# EAGLE design pcb_2 (EAGLE 8.6.0)

## Sheet 1 of 2
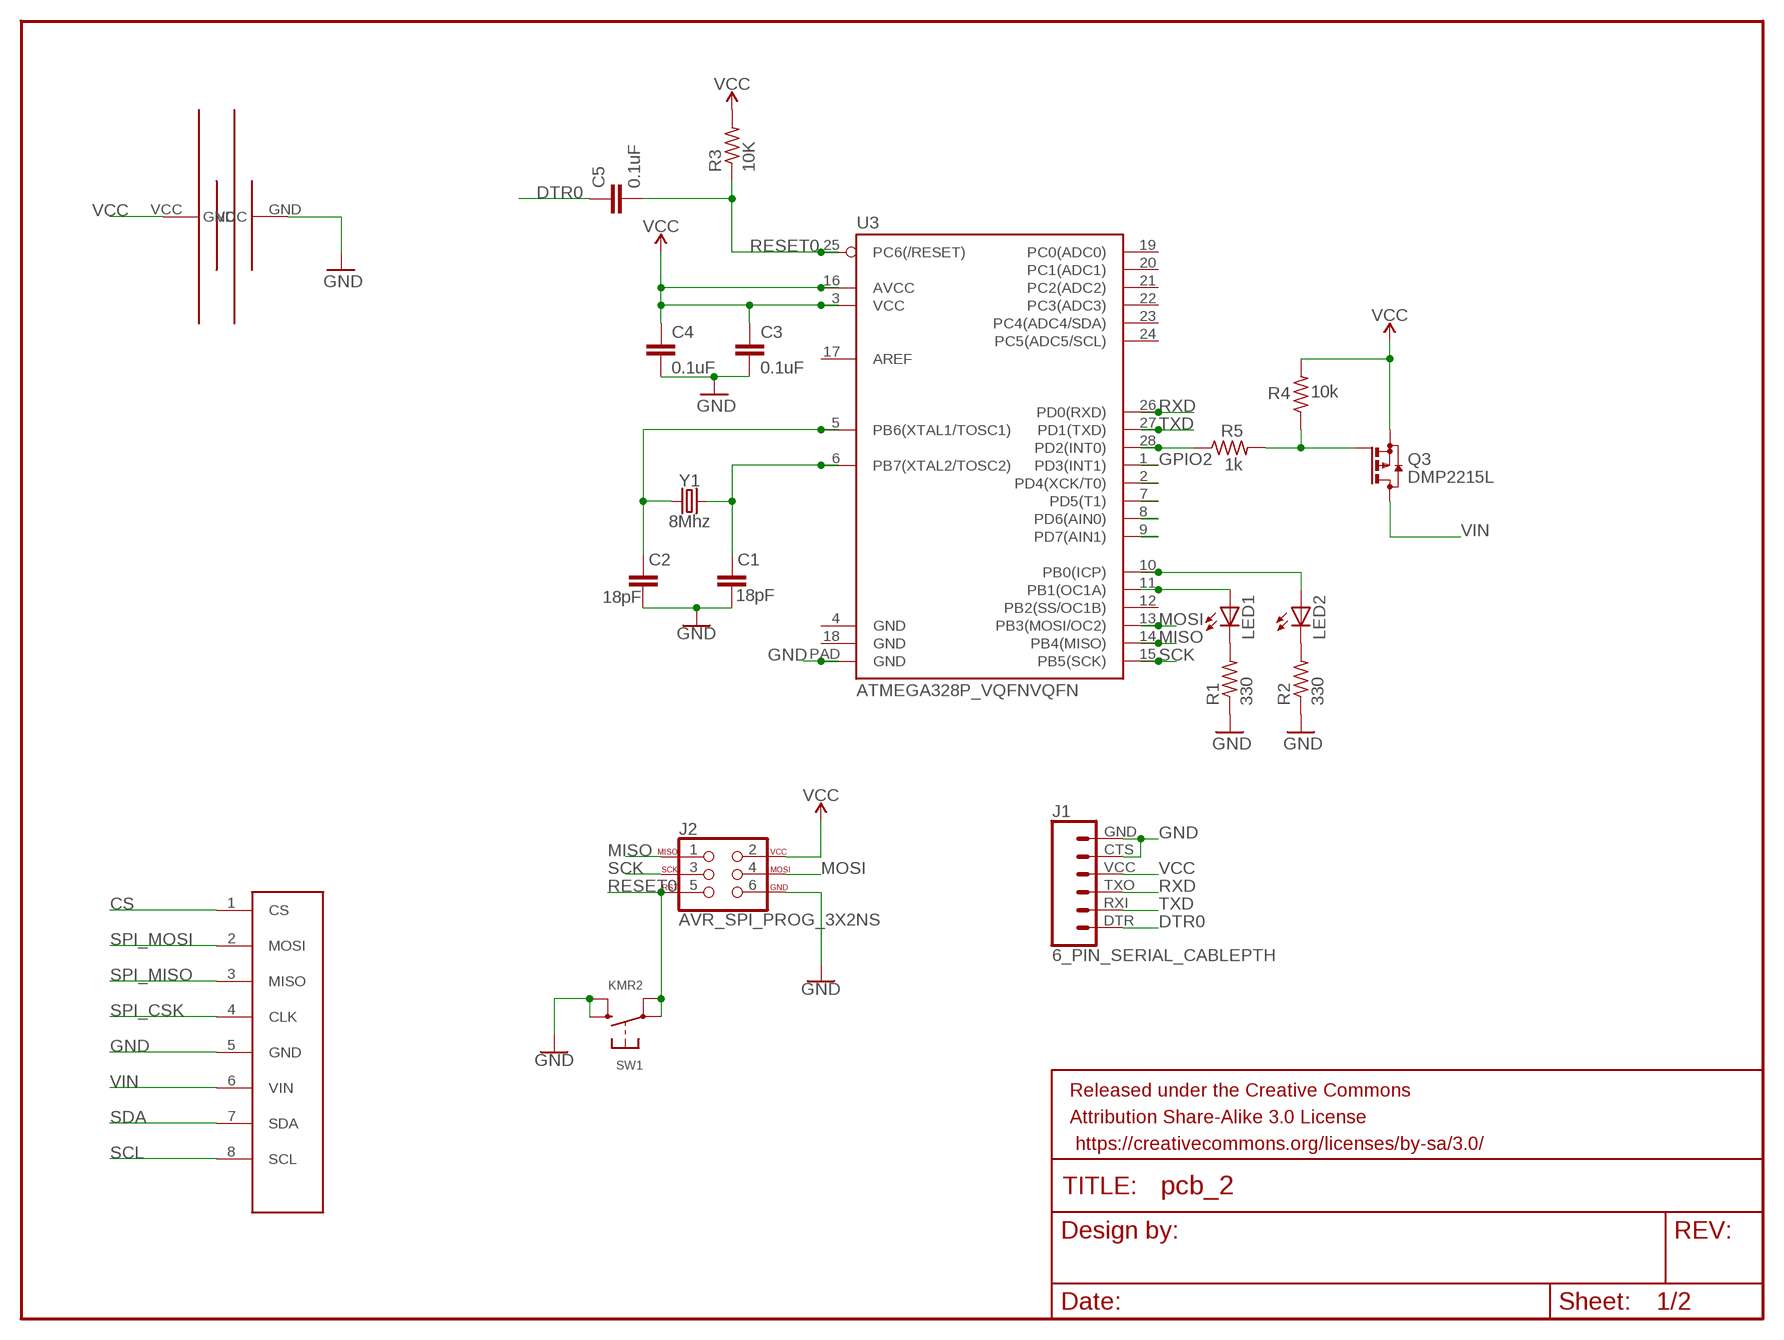
[diagram p0: schematic, sheet 1]

### Parts
C1  18pF  C-EUC0603K  [C0603K]
C2  18pF  C-EUC0603K  [C0603K]
C3  0.1uF  C-EUC0603K  [C0603K]
C4  0.1uF  C-EUC0603K  [C0603K]
C5  0.1uF  C-EUC0603K  [C0603K]
FRAME1  FRAME-LETTER  [CREATIVE_COMMONS]
J1  6_PIN_SERIAL_CABLEPTH  [FTDI_BASIC]
J2  AVR_SPI_PROG_3X2NS  [2X3-NS]
LED1  LED1206  [LED-1206]
LED2  LED1206  [LED-1206]
Q3  DMP2215L  BSS84  [SOT23]
R1  330  R-US_R0603  [R0603]
R2  330  R-US_R0603  [R0603]
R3  10K  R-US_R0603  [R0603]
R4  10k  R-US_R0603  [R0603]
R5  1k  R-US_R0603  [R0603]
SW1  KMR2  SWITCH_TACT_SMT4.6X2.8  [BTN_KMR2_4.6X2.8]
U3  ATMEGA328P_VQFNVQFN  [VQFN-28]
U$1  BATTERY  [D_PACKAGE]
U$6  FLIRFLIR  [1X08_LONGPADS]
Y1  8Mhz  CRYSTALSMD-HC49UP  [HC49UP]

### Nets
CS: U$6.1(CS)
DTR0: C5.1 J1.DTR
FETEN: Q3.1(G) R4.1 R5.2
GND: C1.2 C2.2 C3.2 C4.2 J1.CTS J1.GND J2.6 R1.1 R2.1 SW1.B'(S1) SW1.B(S) U3.PAD(GND) U$1.GND U$6.5(GND) ; also sheet 2
GPIO2: U3.1(PD3(INT1)) ; also sheet 2
MISO: J2.1 U3.14(PB4(MISO))
MOSI: J2.4 U3.13(PB3(MOSI/OC2))
N$1: LED1.C R1.2
N$2: LED1.A U3.11(PB1(OC1A))
N$3: LED2.A U3.10(PB0(ICP))
N$4: U3.9(PD7(AIN1))
N$5: U3.8(PD6(AIN0))
N$6: U3.7(PD5(T1))
N$7: U3.2(PD4(XCK/T0))
N$9: LED2.C R2.2
N$12: R5.1 U3.28(PD2(INT0))
N$19: C1.1 U3.6(PB7(XTAL2/TOSC2)) Y1.2
N$21: C2.1 U3.5(PB6(XTAL1/TOSC1)) Y1.1
RESET0: C5.2 J2.5 R3.1 SW1.A'(P1) SW1.A(P) U3.25(PC6(/RESET))
RXD: J1.TXO U3.26(PD0(RXD))
SCK: J2.3 U3.15(PB5(SCK))
SCL: U$6.8(SCL) ; also sheet 2
SDA: U$6.7(SDA) ; also sheet 2
SPI_CSK: U$6.4(CLK) ; also sheet 2
SPI_MISO: U$6.3(MISO) ; also sheet 2
SPI_MOSI: U$6.2(MOSI) ; also sheet 2
TXD: J1.RXI U3.27(PD1(TXD))
VCC: C3.1 C4.1 J1.VCC J2.2 Q3.2(S) R3.2 R4.2 U3.3(VCC) U3.16(AVCC) U$1.VCC
VIN: Q3.3(D) U$6.6(VIN) ; also sheet 2
Unconnected: U3.4(GND) U3.12(PB2(SS/OC1B)) U3.17(AREF) U3.18(GND) U3.19(PC0(ADC0)) U3.20(PC1(ADC1)) U3.21(PC2(ADC2)) U3.22(PC3(ADC3)) U3.23(PC4(ADC4/SDA)) U3.24(PC5(ADC5/SCL))

## Sheet 2 of 2
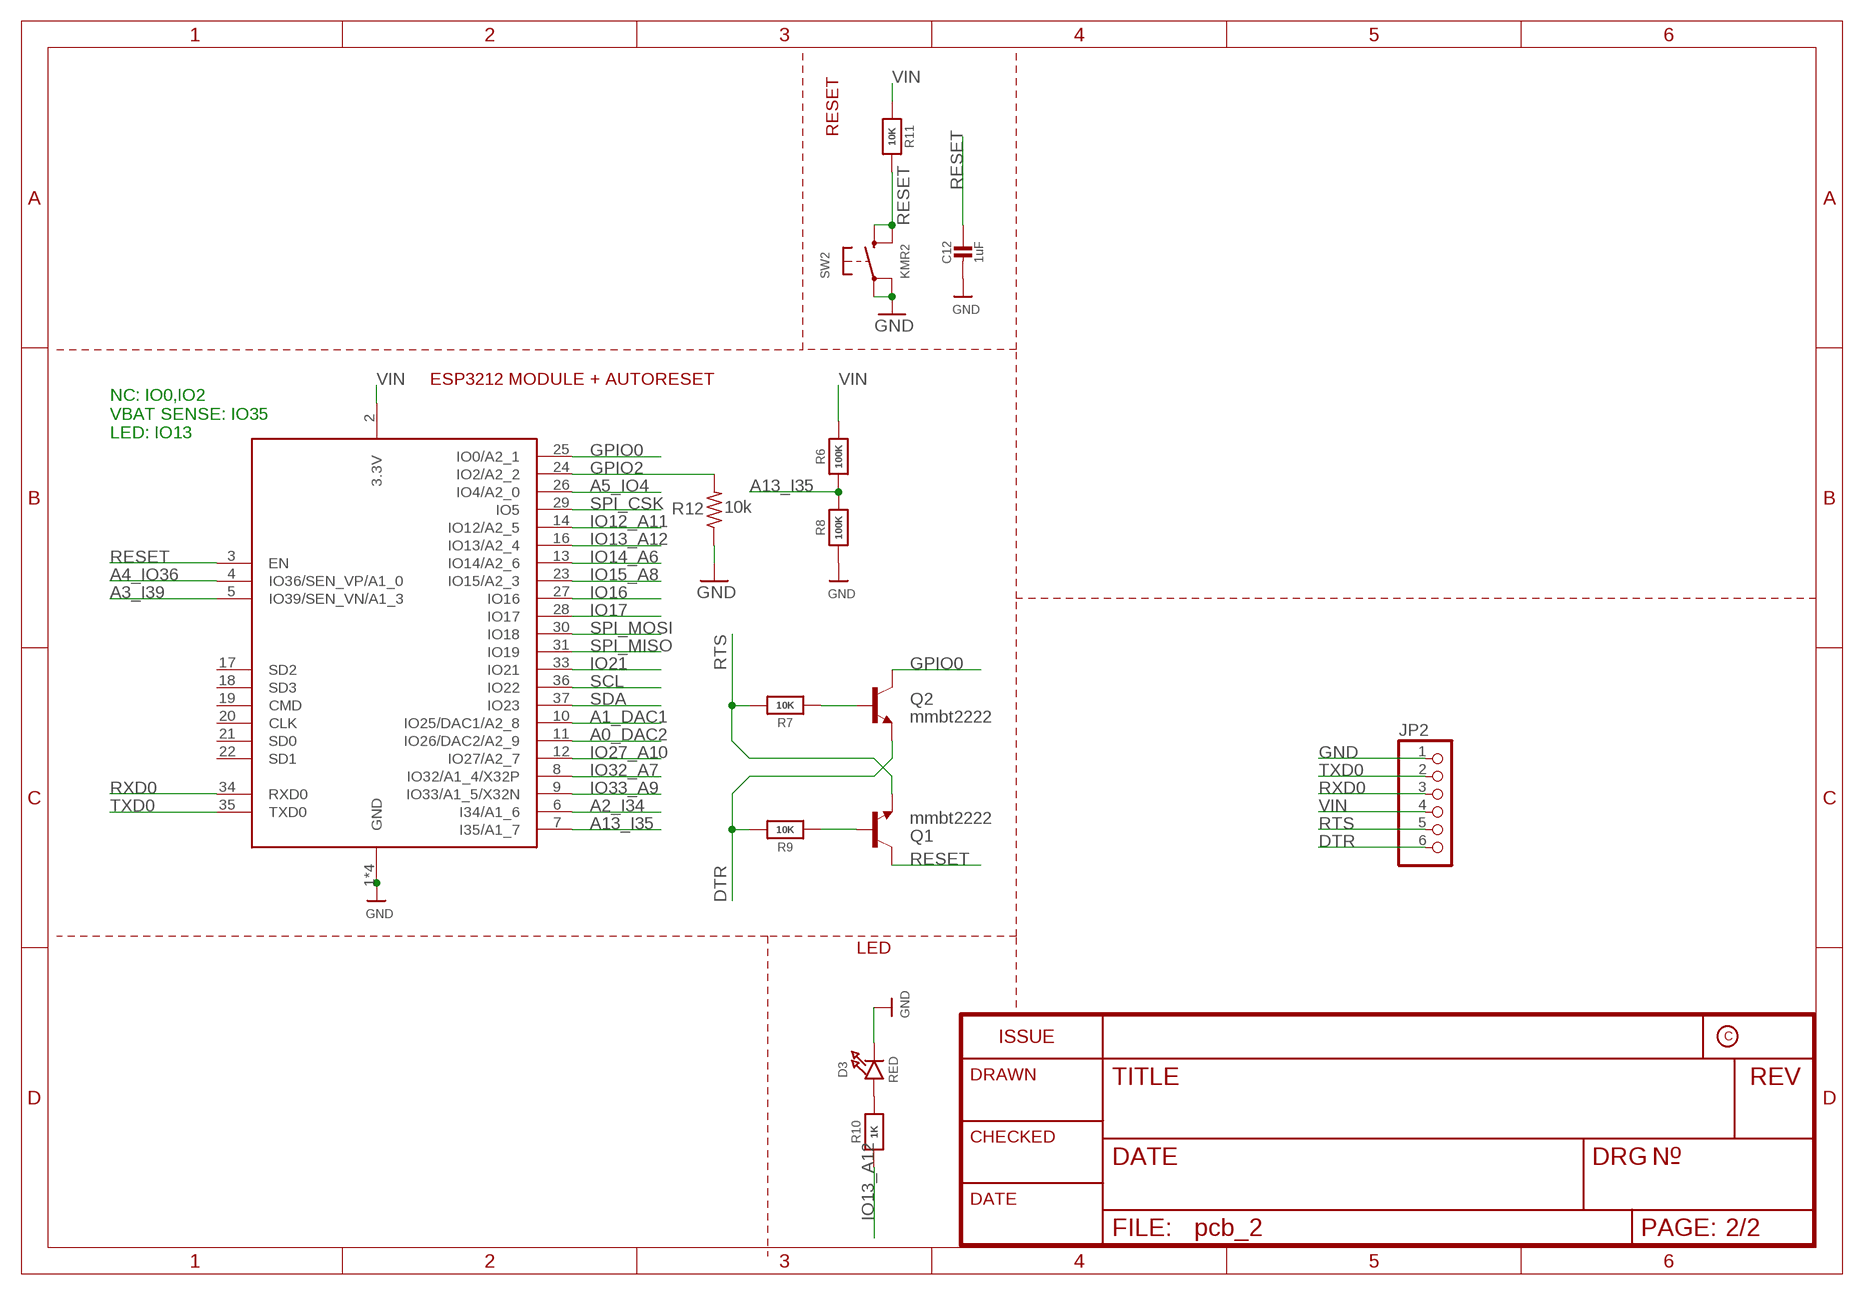
[diagram p1: schematic, sheet 2]

### Parts
C12  1uF  CAP_CERAMIC0603_NO  [0603-NO]
D3  RED  LED0805_NOOUTLINE  [CHIPLED_0805_NOOUTLINE]
JP2  PINHD-1X6  [1X06]
Q1  mmbt2222  TRANSISTOR_NPNSOT23-3  [SOT23-3]
Q2  mmbt2222  TRANSISTOR_NPNSOT23-3  [SOT23-3]
R6  100K  RESISTOR_0603_NOOUT  [0603-NO]
R7  10K  RESISTOR_0603_NOOUT  [0603-NO]
R8  100K  RESISTOR_0603_NOOUT  [0603-NO]
R9  10K  RESISTOR_0603_NOOUT  [0603-NO]
R10  1K  RESISTOR_0603_NOOUT  [0603-NO]
R11  10K  RESISTOR_0603_NOOUT  [0603-NO]
R12  10k  R-US_R0603  [R0603]
SW2  KMR2  SWITCH_TACT_SMT4.6X2.8  [BTN_KMR2_4.6X2.8]
X2  ESP32_WROOM32_SKINNY  [WROOM32_SKINNY]

### Nets
A0_DAC2: X2.11(IO26/DAC2/A2_9)
A1_DAC1: X2.10(IO25/DAC1/A2_8)
A2_I34: X2.6(I34/A1_6)
A3_I39: X2.5(IO39/SEN_VN/A1_3)
A4_IO36: X2.4(IO36/SEN_VP/A1_0)
A5_IO4: X2.26(IO4/A2_0)
A13_I35: R6.1 R8.2 X2.7(I35/A1_7)
DTR: JP2.6 Q2.2(E) R9.2
GND: C12.2 D3.C JP2.1 R8.1 R12.1 SW2.A'(P1) SW2.A(P) X2.1(GND) X2.15(GND) X2.38(GND) X2.P$1(GND) ; also sheet 1
GPIO0: Q2.3(C) X2.25(IO0/A2_1)
GPIO2: R12.2 X2.24(IO2/A2_2) ; also sheet 1
IO12_A11: X2.14(IO12/A2_5)
IO13_A12: R10.1 X2.16(IO13/A2_4)
IO14_A6: X2.13(IO14/A2_6)
IO15_A8: X2.23(IO15/A2_3)
IO16: X2.27(IO16)
IO17: X2.28(IO17)
IO21: X2.33(IO21)
IO27_A10: X2.12(IO27/A2_7)
IO32_A7: X2.8(IO32/A1_4/X32P)
IO33_A9: X2.9(IO33/A1_5/X32N)
N$17: Q1.1(B) R9.1
N$18: Q2.1(B) R7.1
N$22: D3.A R10.2
RESET: C12.1 Q1.3(C) R11.2 SW2.B'(S1) SW2.B(S) X2.3(EN)
RTS: JP2.5 Q1.2(E) R7.2
RXD0: JP2.3 X2.34(RXD0)
SCL: X2.36(IO22) ; also sheet 1
SDA: X2.37(IO23) ; also sheet 1
SPI_CSK: X2.29(IO5) ; also sheet 1
SPI_MISO: X2.31(IO19) ; also sheet 1
SPI_MOSI: X2.30(IO18) ; also sheet 1
TXD0: JP2.2 X2.35(TXD0)
VIN: JP2.4 R6.2 R11.1 X2.2(3.3V) ; also sheet 1
Unconnected: X2.17(SD2) X2.18(SD3) X2.19(CMD) X2.20(CLK) X2.21(SD0) X2.22(SD1)

### Notes on the sheet
- RESET
- ESP3212 MODULE + AUTORESET
- NC: IO0,IO2
  VBAT SENSE: IO35
  LED: IO13
- LED

## Library data of the parts
C1-C5 = rcl:C-EU: CAPACITOR, European symbol; SPICEPREFIX: C
C12 = microbuilder:CAP_CERAMIC: Ceramic Capacitors For new designs, use the packages preceded by an '_' character since they are more reliable: The following footprints should be used on most boards: _0402 - Standard footprint for regular board layouts _0603 - Standard footprint for regular board layouts _0805 - Standard footprint for regular board layouts _1206 - Standard footprint for regular board layouts For extremely tight-pitch boards where space is at a premium, the following 'micro-pitch' footprints can be used (smaller pads, no silkscreen outline, etc.): _0402MP - Micro-pitch footprint for very dense/compact boards _0603MP - Micro-pitch footprint for very dense/compact boards _0805MP - Micro-pitch footprint for very dense/compact boards _1206MP - Micro-pitch footprint for very dense/compact boards
D3 = microbuilder:LED: LED 0603 - 0603 Surface Mount Package 2mA: Green LED - Low Power (3.9mcd, 2ma, 1.7Vf) - Digikey: 475-2709-2-ND Orange LED - Low Power (9.8mcd, 2ma, 1.8Vf) - Digikey: 475-1194-2-ND Red LED - Low Power (5mcd, 2ma, 1.8Vf) - Digikey: 475-1195-2-ND Yellow LED - Low Power (7mcd, 2ma, 1.8Vf) - Digikey: 475-1196-2-ND 5mA: Blue LED - Low Power (17mcd, 5ma, 2.9Vf) - Digikey: LNJ937W8CRACT-ND 0805 - 0805 Surface Mount Package 2mA: Red LED (8.8mcd, 2mA, 1.8Vf, Clear) - Low Power [Digikey: 475-2510-1-ND] Green LED (5mcd, 2mA, 1.8Vf, Clear) - Low Power [Digikey: 475-2730-1-ND] Yellow LED (11.3mcd, 2mA, 1.8Vf, Clear) - Low Power [Digikey: 475-2555-1-ND] 20mA: Red LED (104mcd, 20mA, Diffused) - LS R976 [Digikey: 475-1278-6-ND] Red LED (12mcd, 20mA, 2.0Vf, Clear) - APT2012EC [Digikey: 754-1128-1-ND] Green LED (15mcd, 20mA, 2.2Vf, Clear) - APT2012GC [Digikey: 754-1131-1-ND] Orange LED (160mcd, 20mA, 2.1Vf, Clear) - APT2012SECK [Digikey: 754-1130-1-ND] 1206 - 1206 Surface Mount Package Green LED (26mcd, 20mA, Diffused) - LG N971 [Digikey: 475-1407-6-ND] Red LED (15mcd, 20mA, Diffused) - LH N974 [Digikey: 475-1416-6-ND] Cree - Cree High-Power Surface Mount LEDs XPEBWT-L1-0000-00D50 - White 111lm 350mA 2.9Vf 6200K 110° XTEAWT-00-0000-00000LEE3 - White 114lm 350mA 2.85Vf 5000K 115° Everlight - Everlight 45-21 Series Surface Mount LEDs 45-21/QK2C-B2832AC2CB2/2T - Warm White 2000mcd 20mA 3.25Vf 3050K 120° 45-21/LK2C-B38452C4CB2/2T - Nuetral White 2000mcd 20mA 3.25Vf 4150K 120° 45-21/LK2C-B50634C6CB2/2T - Cold White 2200mcd 20mA 3.25Vf 5650K 120° PLCC2 Reverse Mount LS T77K-J1L2-1-0-2-R18-Z - Red 11.25mcd 2mA 1.8Vf 630nm 120° LO T77K-L1M2-24-Z - Orange 19.6mcd 2mA 1.8Vf 606nm 120° LY T77K-K2M1-26-Z - Yellow 15.7mcd 2mA 1.8Vf 587nm 120°
FRAME1 = SparkFun-Retired:FRAME-LETTER: Schematic Frame Standard 8.5x11 US Letter frame
J1 = SparkFun-Connectors:6_PIN_SERIAL_CABLE: 6-pin header connection for use with the "FTDI BASIC" pinout - CABLE SIDE. Also known as "Arduino Serial Program Header". This is used on a design to provide a 6-pin connection point for serial communication usually from a USB cable (D+/D-) to these headers (RX/TX). It also has the remaining pins necessary for programming in the Arduino evironment (DTR, GND, and sometimes VCC). Note, this device has "CABLE" in the name. It is intended to be used on a design that usually lives on the end of your USB cable and prvides the converter chip (FTDI232 or FTDI231x) to commnicate serial RX/TX. The "sister" device, named "TARGET" is inteneded to be used on a design that contains a target micro-controller that you wish to program. You can populate with some of these: Female Headers <https://www.sparkfun.com/products/115> (PRT-00115) For reference (or to suit your programming needs) check out these designs: SparkFun FTDI Basic Breakout - 5V <https://www.sparkfun.com/products/9716> (DEV-09716) SparkFun FTDI Basic Breakout - 3.3V <https://www.sparkfun.com/products/9873> (DEV-09873) SparkFun FTDI SmartBasic <https://www.sparkfun.com/products/12935> (DEV-12935) SparkFun Beefy 3 - FTDI Basic Breakout <https://www.sparkfun.com/products/13746> (DEV-13746)
J2 = SparkFun-Connectors:AVR_SPI_PROG_3X2: AVR ISP 6 Pin This is the reduced ISP connector for AVR programming. Common on Arduino. This footprint will take up less PCB space and can be used with a 10-pin to 6-pin adapter such as SKU: BOB-08508 **Special note about "TEST_POINT" package. The stop mask is on the top side, so if you want your programming test points to be on the bottom of your board, make sure to place this package on the bottom side of the board. This also ensure that the orientation to program from the bottom side will be correct. SparkFun Products: SparkFun ISP Pogo Adapter <https://www.sparkfun.com/products/11591> - NS Tiny AVR Programmer <https://www.sparkfun.com/products/11801> -PTH
JP2 = pinhead:PINHD-1X6: PIN HEADER
LED1 LED2 = SparkFun-Retired:LED: LEDs Standard schematic elements and footprints for 5mm, 3mm, 1206, and 0603 sized LEDs. 5mm - Spark Fun Electronics SKU : Comp-SBL
Q1 Q2 = SparkFun:TRANSISTOR_NPN: Transistor NPN BJT configuration in SOT23 package. MMBT2222 is the common NPN we use. Double check BCE configuration again layout.
Q3 = transistor-small-signal:BSS84: P-CHANNEL MOS FET
R1 R2 R4 R5 R12 = resistor:R-US_: RESISTOR, American symbol
R3 = rcl:R-US_: RESISTOR, American symbol; SPICEPREFIX: R
R6-R11 = microbuilder:RESISTOR: Resistors For new designs, use the packages preceded by an '_' character since they are more reliable: The following footprints should be used on most boards: _0402 - Standard footprint for regular board layouts _0603 - Standard footprint for regular board layouts _0805 - Standard footprint for regular board layouts _1206 - Standard footprint for regular board layouts For extremely tight-pitch boards where space is at a premium, the following 'micro-pitch' footprints can be used (smaller pads, no silkscreen outline, etc.): _0402MP - Micro-pitch footprint for very dense/compact boards _0603MP - Micro-pitch footprint for very dense/compact boards _0805MP - Micro-pitch footprint for very dense/compact boards _1206MP - Micro-pitch footprint for very dense/compact boards
SW1 SW2 = microbuilder:SWITCH_TACT_SMT: SMT Tact Switches 6x6mm - Digikey: P12940SCT-ND KMR2 (4.6x2.8mm) - Digikey: 401-1426-1-ND EVQ-PQHB55 - Light Touch, 160GF (4.5x4.5mm) - Digikey: P8090SCT-ND KMT0 - KMT021 NGJ LHS (etc.) IP68/Waterproof - Digikey: CKN10289CT-ND
U3 = SparkFun-IC-Microcontroller:ATMEGA328P_VQFN: Atmel 328P QFN part not in catalog
U$1 = d_cell:BATTERY: Bulgin D cell battery holder
U$6 = FLIR:FLIRFLIR: Part for the breakout board for the Flir Lepton
X2 = microbuilder:ESP32_WROOM32
Y1 = SparkFun-Clocks:CRYSTAL: Crystals (Generic) These are passive quartz crystals, which can be used as a clock source for a microcontroller. Crystal's are two-terminal devices. They require external "load" capacitors to generate an oscillating signal.

## Board
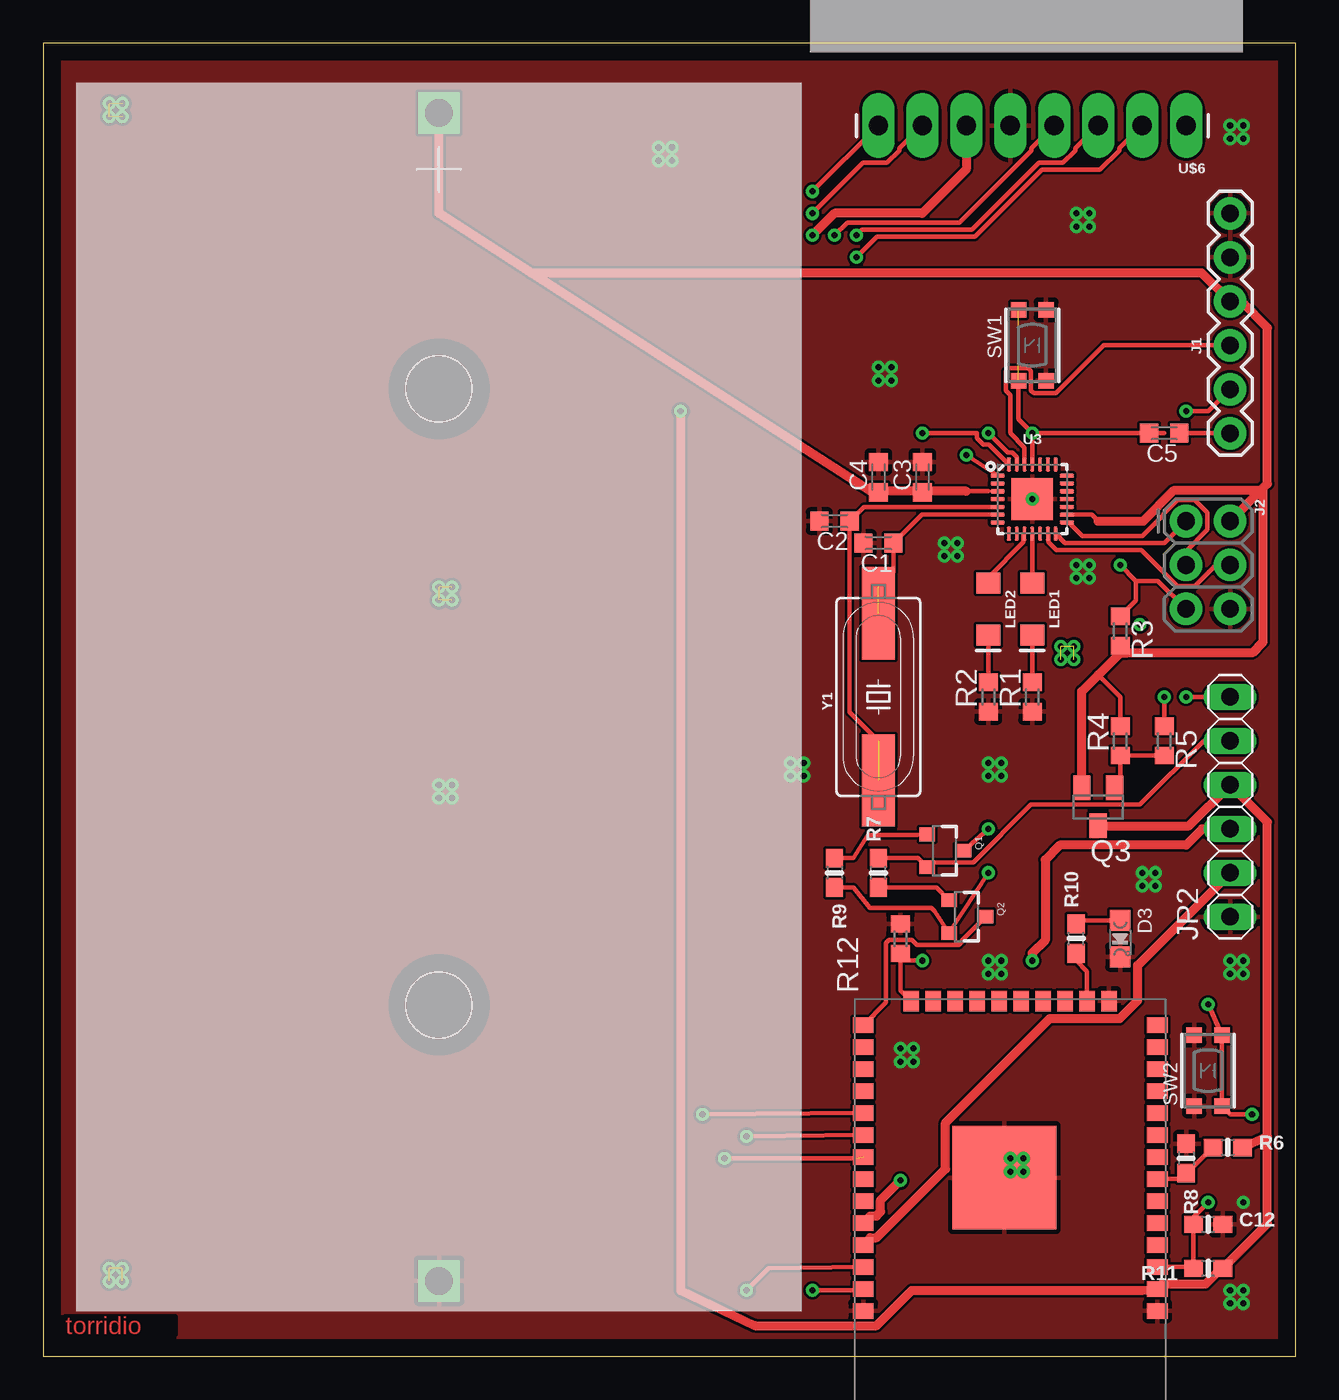
[diagram p2: board, top side]
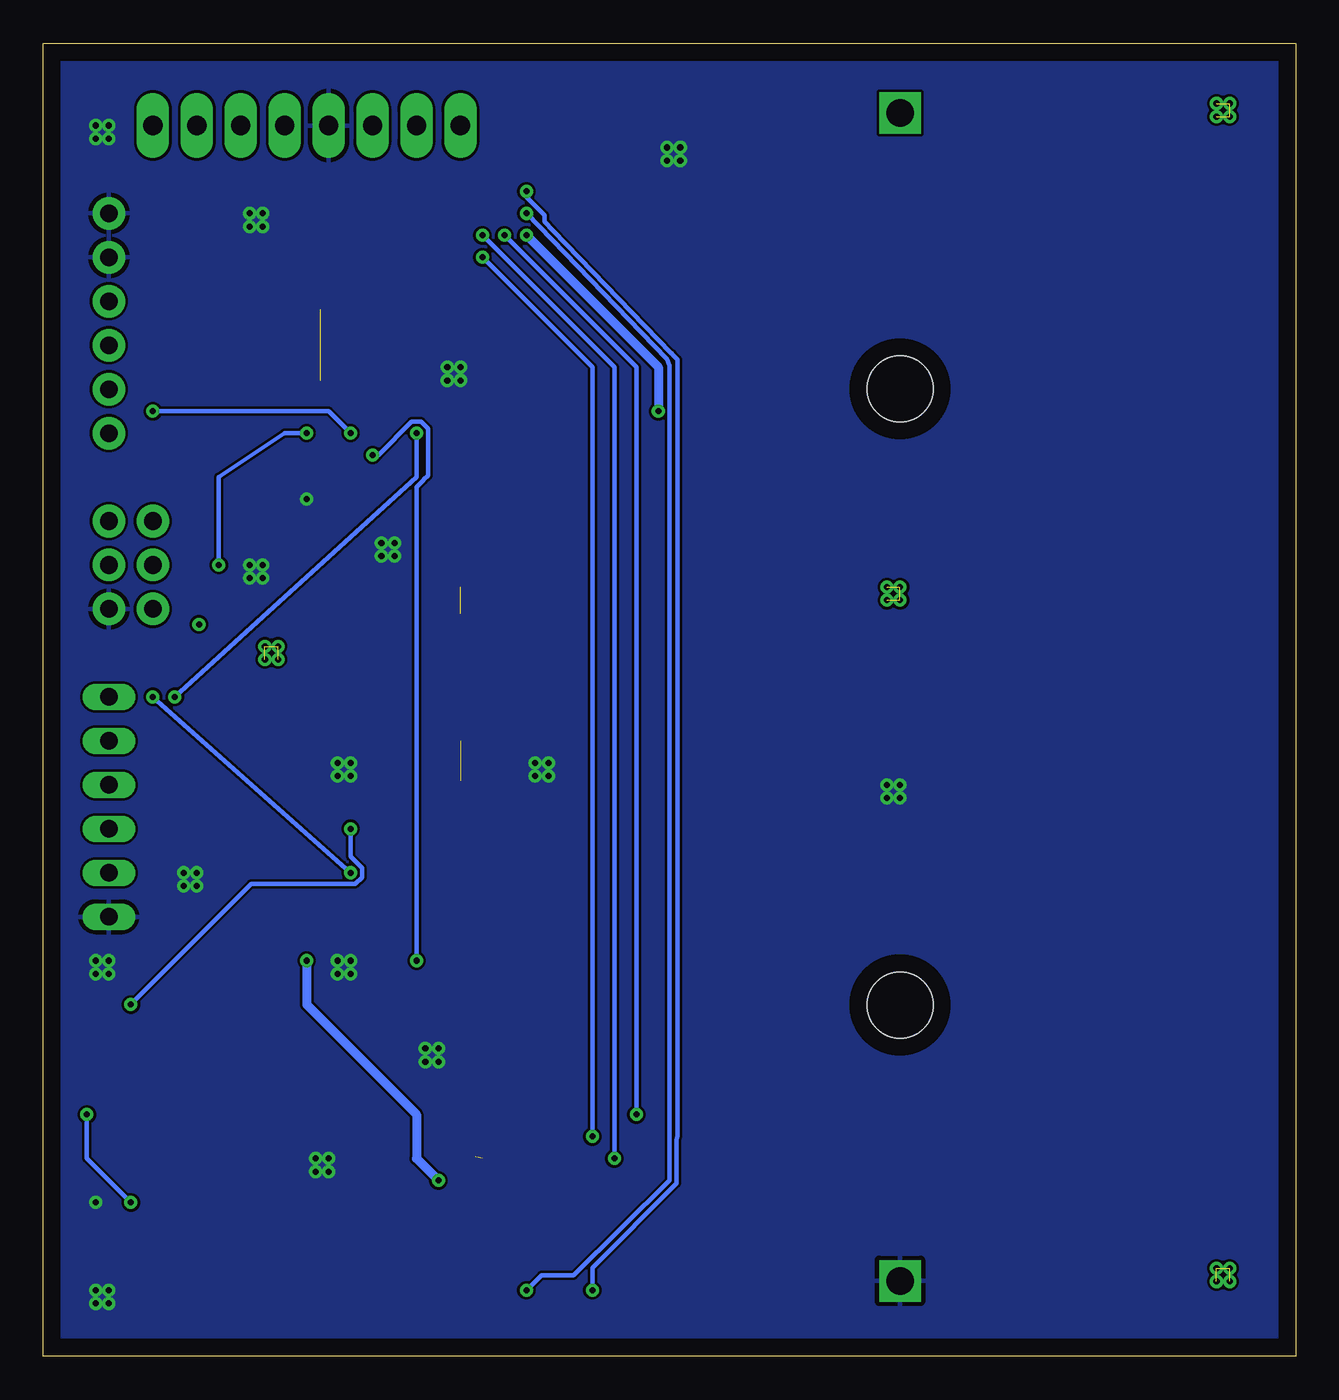
[diagram p3: board, bottom side, seen from below]

Size 72.37 x 75.87 mm. Coordinates in mm from the lower left corner, seen from the top.
Outline: 0,0 72.37,0 72.37,75.87 0,75.87 0,0
Copper layers (1*16): Top 0.035mm / dielectric 1.5mm / Bottom 0.035mm
Design rules "default": minimum track width 6mil, minimum drill 0.35mm, track to track 6mil, track to pad 6mil, pad to pad 6mil, via to via 6mil, smd to smd 6mil, copper to edge 40mil, drill to drill 6mil, minimum pad ring 10mil, minimum via ring 8mil, stop-mask expansion 4mil, vias tented up to drill 0mil, thermal gap 10mil

### Footprints (pad centres in the part's own frame; a part is rotated, then mirrored left to right if it is on the bottom)
C0603K = smd 1.05 x 1.08: 1 -0.875,0; 2 0.875,0
0603-NO = smd 1.075 x 1: 1 -0.85,0; 2 0.85,0
CHIPLED_0805_NOOUTLINE = smd 1.2 x 1.2: A 0,-1.05; C 0,1.05
FTDI_BASIC = drill 1.016 pad 1.88: CTS 10.16,0; DTR 0,0; GND 12.7,0; RXI 2.54,0; TXO 5.08,0; VCC 7.62,0
2X3-NS = drill 1.016 pad 1.88: 1 -2.54,-1.27; 2 -2.54,1.27; 3 0,-1.27; 4 0,1.27; 5 2.54,-1.27; 6 2.54,1.27
1X06 = drill 1.016 long: 1 -6.35,0; 2 -3.81,0; 3 -1.27,0; 4 1.27,0; 5 3.81,0; 6 6.35,0
LED-1206 = smd 1.2 x 1.4: A -1.5,0; C 1.5,0
SOT23-3 = smd 0.8 x 0.9: 1 -0.95,-1; 2 0.95,-1; 3 0,1.1
SOT23 = smd 1 x 1.4: 1 -0.95,-1.1; 2 0.95,-1.1; 3 0,1.1
R0603 = smd 1 x 1.1: 1 -0.85,0; 2 0.85,0
BTN_KMR2_4.6X2.8 = smd 0.9 x 0.9: A 2.05,0.8; A' -2.05,0.8; B 2.05,-0.8; B' -2.05,-0.8
VQFN-28 = smd 0.82 x 0.24: 1 -2,1.35; 2 -2,0.9; 3 -2,0.45; 4 -2,0; 5 -2,-0.45; 6 -2,-0.9; 7 -2,-1.35; 15 2,-1.35; 16 2,-0.9; 17 2,-0.45; 18 2,0; 19 2,0.45; 20 2,0.9; 21 2,1.35 | smd 0.24 x 0.82: 8 -1.35,-2; 9 -0.9,-2; 10 -0.45,-2; 11 0,-2; 12 0.45,-2; 13 0.9,-2; 14 1.35,-2; 22 1.35,2; 23 0.9,2; 24 0.45,2; 25 0,2; 26 -0.45,2; 27 -0.9,2; 28 -1.35,2 | smd 2.4 x 2.4: PAD 0,0
D_PACKAGE = drill 1.6 square: GND 33.75,0; VCC -33.75,0 | hole 3.8: -17.8,0; 17.8,0
1X08_LONGPADS = drill 1.118 pad 1.88 long: 1 0,0; 2 2.54,0; 3 5.08,0; 4 7.62,0; 5 10.16,0; 6 12.7,0; 7 15.24,0; 8 17.78,0
WROOM32_SKINNY = smd 1.2 x 0.9: 1 -8.5,5; 2 -8.5,3.73; 3 -8.5,2.46; 4 -8.5,1.19; 5 -8.5,-0.08; 6 -8.5,-1.35; 7 -8.5,-2.62; 8 -8.5,-3.89; 9 -8.5,-5.16; 10 -8.5,-6.43; 11 -8.5,-7.7; 12 -8.5,-8.97; 13 -8.5,-10.24; 14 -8.5,-11.51; 25 8.5,-11.51; 26 8.5,-10.24; 27 8.5,-8.97; 28 8.5,-7.7; 29 8.5,-6.43; 30 8.5,-5.16; 31 8.5,-3.89; 32 8.5,-2.62; 33 8.5,-1.35; 34 8.5,-0.08; 35 8.5,1.19; 36 8.5,2.46; 37 8.5,3.73; 38 8.5,5 | smd 0.9 x 1.2: 15 -5.7,-12.9; 16 -4.43,-12.9; 17 -3.16,-12.9; 18 -1.89,-12.9; 19 -0.62,-12.9; 20 0.65,-12.9; 21 1.92,-12.9; 22 3.19,-12.9; 23 4.46,-12.9; 24 5.73,-12.9 | smd 6 x 6: P$1 0.34,-2.7
HC49UP = smd 5.334 x 1.93: 1 -4.826,0; 2 4.826,0

### Placement (x,y rotation side)
C1  48.26,46.99 180 top
C2  45.72,48.26 180 top
C3  50.8,50.8 90 top
C4  48.26,50.8 90 top
C5  64.77,53.34 180 top
C12  67.31,7.62 0 top
D3  62.23,24.13 180 top
FRAME1  -77.47,76.2 0 top  (outside the outline)
J1  68.58,53.34 90 top
J2  67.31,45.72 270 top
JP2  68.58,31.75 90 top
LED1  57.15,43.18 270 top
LED2  54.61,43.18 270 top
Q1  52.07,29.21 270 top
Q2  53.34,25.4 270 top
Q3  60.96,31.75 180 top
R1  57.15,38.1 90 top
R2  54.61,38.1 90 top
R3  62.23,41.91 270 top
R4  62.23,35.56 90 top
R5  64.77,35.56 270 top
R6  68.45,12.06 0 top
R7  48.26,27.94 90 top
R8  66.04,11.43 270 top
R9  45.72,27.94 270 top
R10  59.69,24.13 90 top
R11  67.31,5.08 180 top
R12  49.53,24.13 270 top
SW1  57.15,58.42 90 top
SW2  67.31,16.51 90 top
U3  57.15,49.53 0 top
U$1  22.86,38.1 270 top
U$6  66.04,71.12 180 top
X2  55.88,7.62 180 top
Y1  48.26,38.1 90 top

### Tracks (layer width: path | path; a pad name or v marks a point on that pad's centre or on a via)
A13_I35
  Top 0.254: X2.7 65.7,10.24 R8.2 R6.1
DTR  (via drill 0.35)
  Top 0.254: R9.2 46.83,27.09 47.77,25.89 49.81,25.89 51.31,25.91 51.51,25.72 Q2.2 v54.61,27.94 | JP2.6 v66.04,38.1
  Bottom 0.254: v66.04,38.1 v54.61,27.94
DTR0
  Top 0.254: C5.1 J1.DTR
FETEN
  Top 0.254: Q3.1 62.23,33.17 R4.1 R5.2
GND  (via drill 0.35)
  other vias: 48.26,57.15 48.26,56.39 49.02,57.15 49.02,56.39 49.53,17.78 49.53,17.02 50.29,17.78 50.29,17.02 54.61,22.86 54.61,22.1 55.37,22.86 55.37,22.1 68.58,3.81 68.58,3.05 69.34,8.89 69.34,3.05 68.58,22.86 68.58,22.1 69.34,22.86 69.34,22.1 63.5,27.94 63.5,27.18 64.26,27.94 64.26,27.18 54.61,34.29 54.61,33.53 55.37,34.29 55.37,33.53 59.69,45.72 59.69,44.96 60.45,45.72 60.45,44.96 52.07,46.99 52.07,46.23 52.83,46.99 52.83,46.23 59.69,66.04 59.69,65.28 60.45,66.04 60.45,65.28 68.58,71.12 68.58,70.36 69.34,71.12 69.34,70.36 35.56,69.85 35.56,69.09 36.32,69.85 36.32,69.09 43.18,34.29 43.18,33.53 43.94,34.29 43.94,33.53 22.86,33.02 22.86,32.26 23.62,33.02 23.62,32.26 69.34,3.81 55.88,11.43 55.88,10.67 56.64,11.43 56.64,10.67 57.15,49.53
  pour Bottom: 0,76.2 72.39,76.2 72.39,0 0,0
  pour Top: 0,76.2 72.39,76.2 72.39,0 0,0
GND9  (via drill 0.35)  (3 unrouted)
  other vias: 22.86,44.45 22.86,43.69 23.62,44.45 23.62,43.69
GND12  (via drill 0.35)  (3 unrouted)
  other vias: 3.81,5.08 3.81,4.32 4.57,5.08 4.57,4.32
GND13  (via drill 0.35)  (3 unrouted)
  other vias: 3.81,72.39 3.81,71.63 4.57,72.39 4.57,71.63
GND19  (via drill 0.35)  (3 unrouted)
  other vias: 58.8,41.02 58.8,40.26 59.56,41.02 59.56,40.26
GND20  (via drill 0.35)
  other vias: 63.37,42.29
GPIO0
  Top 0.254: Q2.3 53.07,24.03 53.07,23.93 52.91,23.77 50.48,23.77 50.2,24.06 48.86,24.06 48.7,23.9 48.7,20.45 X2.25
GPIO2  (via drill 0.35)
  Top 0.254: R12.2 49.53,22.86 | 49.53,22.86 49.53,21.14 X2.24 | U3.1 v53.34,52.07 | v50.8,22.86 49.53,22.86
  Bottom 0.254: v53.34,52.07 53,52.07 51.07,54 50.53,54 50.14,53.61 50.14,50.88 50.38,50.65 50.38,50.64 50.8,50.22 v50.8,22.86
IO13_A12
  Top 0.254: R10.1 59.69,22.86 60.31,22.24 X2.16
MISO
  Top 0.254: U3.14 59.04,46.99 62.23,46.99 64.77,46.99 J2.1
MOSI
  Top 0.254: J2.4 67.76,45.72 66.55,44.5 65.53,44.5 63.45,46.58 58.56,46.58 58.09,47.05 58.09,47.49 U3.13
N$1
  Top 0.254: LED1.C R1.2
N$2
  Top 0.254: U3.11 LED1.A
N$3
  Top 0.254: U3.10 56.65,47.48 56.65,47.04 54.61,45 LED2.A
N$9
  Top 0.254: LED2.C R2.2
N$12  (via drill 0.35)
  Top 0.254: R5.1 v64.77,38.1 | U3.28 54.65,52.68 54.34,52.68 53.95,53.07 53.95,53.34 v50.8,53.34
  Bottom 0.254: v64.77,38.1 50.8,50.8 v50.8,53.34
N$17
  Top 0.254: R9.1 46.83,28.79 47.64,30.11 50.52,30.11 Q1.1
N$18
  Top 0.254: Q2.1 51.6,27.09 R7.1
N$19  (1 unrouted)
  Top 0.254: U3.6 50.77,48.63 C1.1 49.13,45.33 48.26,44.45
N$21  (1 unrouted)
  Top 0.254: U3.5 47.41,49.08 C2.1 46.59,47.66 46.58,47.65 46.58,37.24 48.26,35.56
N$22
  Top 0.254: R10.2 59.89,25.18 D3.A
RESET  (via drill 0.35)
  Top 0.254: X2.3 66.38,5.16 | 66.38,5.16 R11.2 | 66.38,5.16 66.46,5.24 C12.1 66.46,8.04 v67.31,8.89 | v69.85,13.97 68.6,13.97 SW2.B' SW2.B v67.31,20.32 | Q1.3 v54.61,30.48
  Bottom 0.254: v67.31,8.89 69.85,11.43 v69.85,13.97 | v54.61,30.48 54.61,28.87 53.95,28.21 53.95,27.67 54.34,27.28 60.35,27.28 v67.31,20.32
RESET0  (via drill 0.35)  (1 unrouted)
  Top 0.254: J2.5 64.41,44.81 63.14,44.81 | 63.14,44.81 v62.23,45.72 | v57.15,53.34 U3.25 | 64.77,53.34 C5.2 v57.15,53.34 | SW1.A' 56.35,54.14 v57.15,53.34 | R3.1 63.14,43.67 63.14,44.81
  Bottom 0.254: v62.23,45.72 62.23,50.8 58.42,53.34 v57.15,53.34
RTS
  Top 0.254: JP2.5 67.06,35.56 63.38,31.87 57.08,31.87 53.74,28.53 51.34,28.53 Q1.2 50.54,28.79 R7.2
RXD
  Top 0.254: U3.26 56.7,52.52 55.88,53.34 55.88,55.55 55.62,55.8 55.62,56.94 55.78,57.1 56.92,57.1 57.08,56.94 57.08,55.8 57.24,55.64 58.52,55.64 61.3,58.42 J1.TXO
RXD0  (via drill 0.35)
  Top 0.508: JP2.3 66.97,30.48 66.04,29.54 58.75,29.54 57.9,28.69 57.9,24.04 57.15,23.3 v57.15,22.86 | X2.34 47.79,8.11 48.15,8.11 48.39,8.35 48.39,9.02 v49.53,10.16
  Bottom 0.508: v57.15,22.86 57.15,20.32 50.8,13.97 50.8,11.43 v49.53,10.16
SCK
  Top 0.254: J2.3 66.04,46.54 67.26,47.76 67.26,48.77 66.55,49.48 65.53,49.48 64.72,48.67 64.72,48.62 63.5,47.4 60.03,47.4 59.25,48.18 U3.15
SCL  (via drill 0.35)
  Top 0.254: U$6.8 v44.45,67.31 | v40.64,3.81 41.91,5.08 X2.36
  Bottom 0.254: v44.45,67.31 44.45,66.97 43.41,65.93 43.41,65.55 42.91,65.03 36.1,57.97 36.03,57.94 35.99,57.86 35.73,57.6 35.73,12.75 35.77,12.49 35.77,9.99 40.64,5.12 v40.64,3.81
SDA  (via drill 0.35)
  Top 0.254: X2.37 47.3,3.81 v44.45,3.81 | U$6.7 49.48,69.8 49.48,69.67 48.77,68.96 47.37,68.96 v44.45,66.04
  Bottom 0.254: v44.45,3.81 43.59,4.67 41.74,4.67 36.17,10.16 36.17,57.25 36.34,57.63 v44.45,66.04
SPI_CSK  (via drill 0.35)
  Top 0.254: U$6.4 57.1,69.8 57.1,69.67 52.93,65.51 46.46,65.51 v45.72,64.77 | v38.1,13.97 X2.29
  Bottom 0.254: v45.72,64.77 38.1,57.15 v38.1,13.97
SPI_MISO  (via drill 0.35)  (1 unrouted)
  Top 0.254: 61.04,71.2 U$6.3 59.64,69.8 59.64,69.67 58.92,68.96 57.53,68.96 53.67,65.1 47.32,65.1 v46.99,64.77 | v39.37,11.43 46.99,11.43
  Bottom 0.254: v46.99,64.77 39.37,57.15 v39.37,11.43
SPI_MOSI  (via drill 0.35)
  Top 0.254: U$6.2 62.18,69.8 62.18,69.67 61.06,68.56 57.7,68.56 53.84,64.69 48.18,64.69 v46.99,63.5 | v40.64,12.7 X2.30
  Bottom 0.254: v46.99,63.5 40.64,57.15 v40.64,12.7
TXD  (via drill 0.35)
  Top 0.254: v54.61,53.34 55.73,52.22 56,52.22 56.25,51.97 U3.27 | v66.04,54.61 67.31,54.61 J1.RXI
  Bottom 0.254: v54.61,53.34 55.88,54.61 v66.04,54.61
TXD0
  Top 0.508: X2.35 47.79,6.84 48.15,6.84 52.13,10.83 52.13,13.49 58.16,19.51 62.2,19.51 63.24,20.55 63.24,22.6 JP2.2
VCC
  Top 0.152: U3.3 54.61,49.98 53.91,49.98 53.85,50.04
  Top 0.254: 60.96,39.37 62.23,38.1 R4.2 | C4.1 48.26,49.98 | C3.1 50.8,49.98 | 54.61,49.98 53.34,49.98 | U3.16 60.59,48.63 60.96,48.26
  Top 0.508: 53.34,49.98 50.8,49.98 48.26,49.98 47.81,49.98 28.19,62.61 | 28.19,62.61 22.86,66.04 U$1.VCC | J2.2 70.33,50.01 | 70.48,50.16 70.74,50.42 70.74,59.44 69.22,60.96 J1.VCC 66.93,62.61 28.19,62.61 | 70.48,50.16 70.48,41.27 69.85,40.64 62.65,40.64 | 62.65,40.64 62.23,40.64 60.96,39.37 60.01,38.42 Q3.2 | 62.65,40.64 R3.2 | 70.48,50.16 70.33,50.01 | 60.96,48.26 63.56,48.26 65.31,50.01 70.33,50.01
VIN  (via drill 0.35)
  Top 0.508: 70.74,12.7 70.74,7.66 R11.1 68.07,5.08 67.17,4.17 64.66,4.17 X2.2 63.5,3.81 50.2,3.81 48.15,1.76 41.13,1.76 36.83,3.81 v36.83,54.61 | 70.74,12.7 70.74,30.86 JP2.4 66.21,30.65 Q3.3 | U$6.6 53.34,68.58 50.8,66.04 45.72,66.04 v44.45,64.77 | R6.2 70.74,12.7
  Bottom 0.508: v44.45,64.77 36.83,57.15 v36.83,54.61

### Text on the board
Top: torridio